# Altium project Pible_MODA.PrjPcb
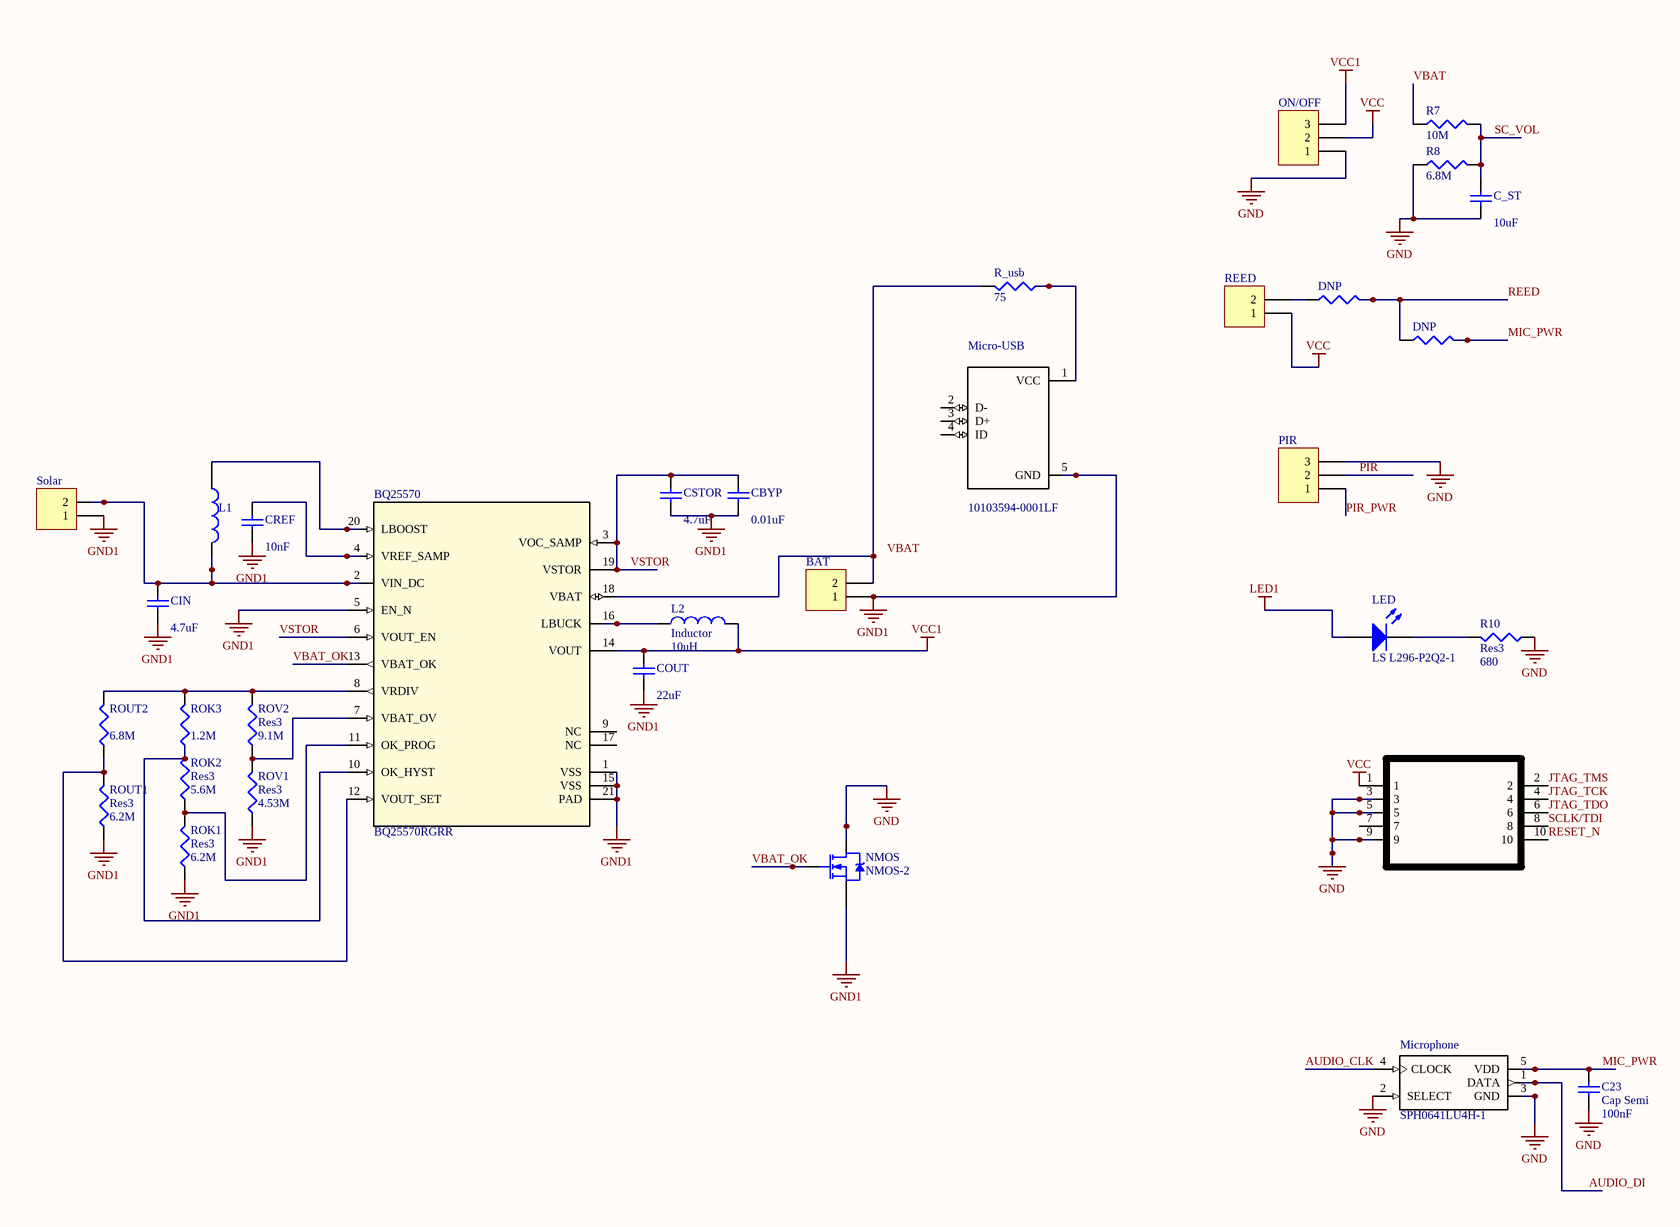
[diagram p0: Pible_MODA.SchDoc, left]
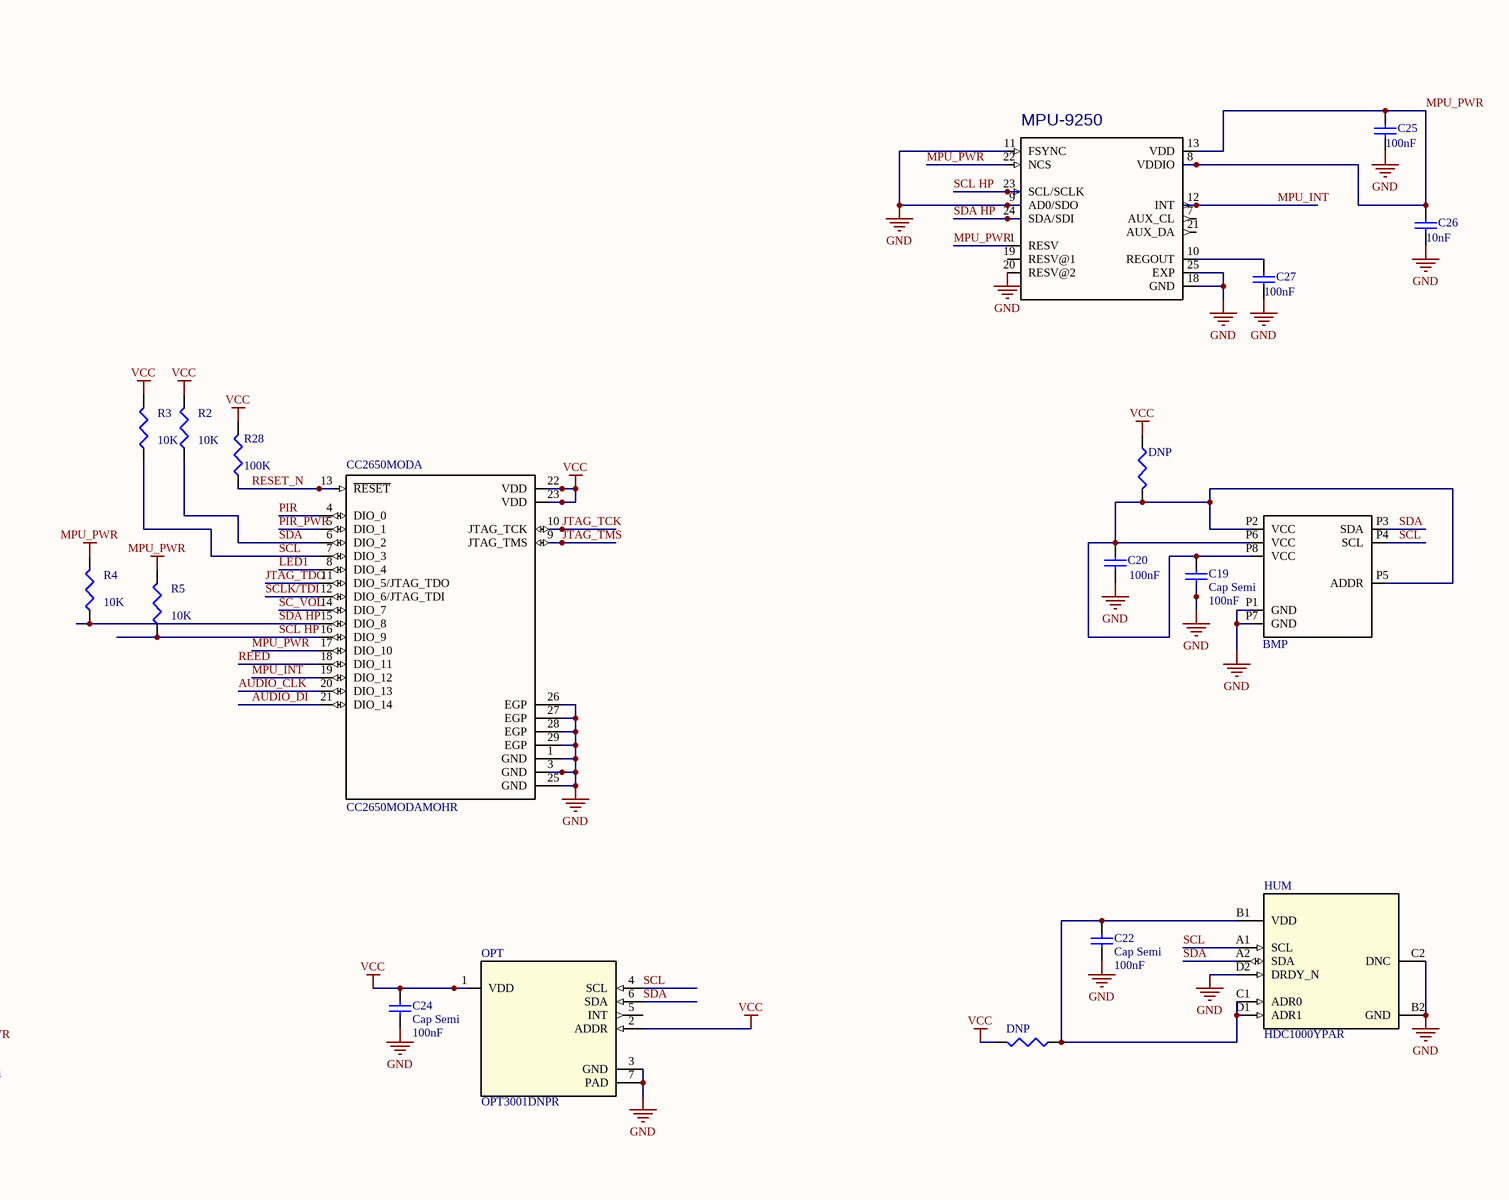
[diagram p1: Pible_MODA.SchDoc, right]
1 sheet, 52 parts. Net scope: global (net labels, ports and power ports of the same name join across sheets).
Board file: Pible_MODA.PcbDoc

## Sheet Pible_MODA.SchDoc
size 635 x 241 mm

### Parts
(Parts that share a designator on the sheet are numbered #1, #2 ... from top to bottom, then left to right.)
BAT  Header 2  [HDR1X2]  (value not drawn)
BMP  BMP280  [LGA-8_BMP280(Primary)]  (value not drawn)
BQ25570  BQ25570RGRR  [RGR0020A]
C19  Cap Semi  value 100nF  [CAPC1608X90]
C20  value 100nF  [CAPC1608X90]  (hidden comment: Cap Semi)
C22  Cap Semi  value 100nF  [CAPC1608X90]
C23  Cap Semi  value 100nF  [1608[0603]]
C24  Cap Semi  value 100nF  [1608[0603]]
C25  value 100nF  [CAPC1608X90]  (hidden comment: Cap Semi)
C26  value 10nF  [CAPC1608X90]  (hidden comment: Cap Semi)
C27  value 100nF  [CAPC1608X90]  (hidden comment: Cap Semi)
C_ST  value 10uF  [1608[0603]]  (hidden comment: Cap Semi)
CBYP  value 0.01uF  [CAPC1608X90]  (hidden comment: Cap Semi)
CC2650MODA  CC2650MODAMOHR  [CC2650MODA_Longer]
CIN  value 4.7uF  [CAPC2012X70]  (hidden comment: Cap Semi)
COUT  value 22uF  [0805]  (hidden comment: Cap Semi)
CREF  value 10nF  [CAPC1608X90]  (hidden comment: Cap Semi)
CSTOR  value 4.7uF  [CAPC1608X90]  (hidden comment: Cap Semi)
DNP#1  Res3  [0402]  (value not drawn)
DNP#2  Res3  [0402]  (value not drawn)
DNP#3  Res3  [0402]  (value not drawn)
DNP#4  Res3  [0402]  (value not drawn)
HUM  HDC1000YPAR  [YPA0008AGAE]
JTAG  FTSH-105-01-L-DV-K  [SAMTEC_FTSH-105-01-L-DV-K]  (value not drawn)
L1  LPS4018-223MRB  [LPS4018]  (value not drawn)
L2  Inductor  value 10uH  [1008HQ]
LED  LS L296-P2Q2-1  [1608]
Micro-USB  10103594-0001LF  [POS-5]
Microphone  SPH0641LU4H-1  [MIC_SPH0641LU4H-1]
MPU-9250  MPU-9250  [QFN40P300X300X105-25N]  (value not drawn)
NMOS  NMOS-2  [SON8-Q5A]
ON/OFF  (no value)  [HDR1X3]
OPT  OPT3001DNPR  [DNP0006A]
PIR  (no value)  [TO-39]
R2  value 10K  [CAPC1608X90]  (hidden comment: Res3)
R3  value 10K  [CAPC1608X90]  (hidden comment: Res3)
R4  value 10K  [CAPC1608X90]  (hidden comment: Res3)
R5  value 10K  [CAPC1608X90]  (hidden comment: Res3)
R7  value 10M  [CAPC1608X90]  (hidden comment: Res3)
R8  value 6.8M  [CAPC1608X90]  (hidden comment: Res3)
R10  Res3  value 680  [Model Name]
R28  value 100K  [CAPC1608X90]
R_usb  value 75  [CAPC1608X90]  (hidden comment: Res3)
REED  Header 2  [HDR1X2]  (value not drawn)
ROK1  Res3  value 6.2M  [CAPC1608X90]
ROK2  Res3  value 5.6M  [CAPC1608X90]
ROK3  value 1.2M  [CAPC1608X90]  (hidden comment: Res3)
ROUT1  Res3  value 6.2M  [CAPC1608X90]
ROUT2  value 6.8M  [CAPC1608X90]  (hidden comment: Res3)
ROV1  Res3  value 4.53M  [CAPC1608X90]
ROV2  Res3  value 9.1M  [CAPC1608X90]
Solar  Header 2  [HDR1X2]  (value not drawn)

### Nets
GND: BMP.P1(GND) BMP.P7(GND) C19.1 C20.2 C22.2 C23.2 C24.2 C25.2 C26.2 C27.2 C_ST.1 CC2650MODA.1(GND) CC2650MODA.3(GND) CC2650MODA.25(GND) CC2650MODA.26(EGP) CC2650MODA.27(EGP) CC2650MODA.28(EGP) CC2650MODA.29(EGP) HUM.B2(GND) HUM.C2(DNC) HUM.D2(DRDY_N) JTAG.3 JTAG.5 JTAG.9 Microphone.2(SELECT) Microphone.3(GND) MPU-9250.9(AD0/SDO) MPU-9250.11(FSYNC) MPU-9250.18(GND) MPU-9250.20(RESV@2) MPU-9250.25(EXP) NMOS.2(D) ON/OFF.1 OPT.3(GND) OPT.7(PAD) PIR.3 R8.1 R10.1
GND1: BAT.1 BQ25570.1(VSS) BQ25570.5(EN_N) BQ25570.15(VSS) BQ25570.21(PAD) CBYP.1 CIN.1 COUT.1 CREF.1 CSTOR.1 Micro-USB.5(GND) NMOS.3(S) ROK1.1 ROUT1.1 ROV1.1 Solar.1
LED1: CC2650MODA.8(DIO_4) LED.1(A)
MPU_PWR: C25.1 C26.1 CC2650MODA.17(DIO_10) MPU-9250.1(RESV) MPU-9250.8(VDDIO) MPU-9250.13(VDD) MPU-9250.22(NCS) R4.2 R5.2
VCC: C24.1 CC2650MODA.22(VDD) CC2650MODA.23(VDD) DNP#3.1 DNP#4.2 JTAG.1 ON/OFF.2 OPT.1(VDD) OPT.2(ADDR) R2.2 R3.2 R28.2 REED.1
VCC1: BQ25570.14(VOUT) COUT.2 L2.2 ON/OFF.3
AUDIO_CLK: CC2650MODA.20(DIO_13) Microphone.4(CLOCK)
AUDIO_DI: CC2650MODA.21(DIO_14) Microphone.1(DATA)
JTAG_TCK: CC2650MODA.10(JTAG_TCK) JTAG.4
JTAG_TDO: CC2650MODA.11(DIO_5/JTAG_TDO) JTAG.6
JTAG_TMS: CC2650MODA.9(JTAG_TMS) JTAG.2
MIC_PWR: C23.1 DNP#2.2 Microphone.5(VDD)
MPU_INT: CC2650MODA.19(DIO_12) MPU-9250.12(INT)
PIR: CC2650MODA.4(DIO_0) PIR.2
PIR_PWR: CC2650MODA.5(DIO_1) PIR.1
REED: CC2650MODA.18(DIO_11) DNP#1.2 DNP#2.1
RESET_N: CC2650MODA.13(~{RESET}) JTAG.10 R28.1
SC_VOL: C_ST.2 CC2650MODA.14(DIO_7) R7.2 R8.2
SCL: BMP.P4(SCL) CC2650MODA.7(DIO_3) HUM.A1(SCL) OPT.4(SCL) R3.1
SCL HP: CC2650MODA.16(DIO_9) MPU-9250.23(SCL/SCLK) R5.1
SCLK/TDI: CC2650MODA.12(DIO_6/JTAG_TDI) JTAG.8
SDA: BMP.P3(SDA) CC2650MODA.6(DIO_2) HUM.A2(SDA) OPT.6(SDA) R2.1
SDA HP: CC2650MODA.15(DIO_8) MPU-9250.24(SDA/SDI) R4.1
VBAT: R7.1
VBAT_OK: BQ25570.13(VBAT_OK) NMOS.1(G)
VSTOR: BQ25570.3(VOC_SAMP) BQ25570.6(VOUT_EN) BQ25570.19(VSTOR) CBYP.2 CSTOR.2
NetBAT_2: BAT.2 BQ25570.18(VBAT) R_usb.2
NetBMP_P2: BMP.P2(VCC) BMP.P5(ADDR) BMP.P6(VCC) BMP.P8(VCC) C19.2 C20.1 DNP#3.2
NetBQ25570_2: BQ25570.2(VIN_DC) CIN.2 L1.2 Solar.2
NetBQ25570_4: BQ25570.4(VREF_SAMP) CREF.2
NetBQ25570_7: BQ25570.7(VBAT_OV) ROV1.2 ROV2.1
NetBQ25570_8: BQ25570.8(VRDIV) ROK3.2 ROUT2.2 ROV2.2
NetBQ25570_10: BQ25570.10(OK_HYST) ROK2.2 ROK3.1
NetBQ25570_11: BQ25570.11(OK_PROG) ROK1.2 ROK2.1
NetBQ25570_12: BQ25570.12(VOUT_SET) ROUT1.2 ROUT2.1
NetBQ25570_16: BQ25570.16(LBUCK) L2.1
NetBQ25570_20: BQ25570.20(LBOOST) L1.1
NetC22_1: C22.1 DNP#4.1 HUM.B1(VDD) HUM.C1(ADR0) HUM.D1(ADR1)
NetC27_1: C27.1 MPU-9250.10(REGOUT)
NetDNP#1_1: DNP#1.1 REED.2
NetLED_2: LED.2(K) R10.2
NetMicro-USB_1: Micro-USB.1(VCC) R_usb.1

Not connected (* = marked no-connect by the designer): BQ25570 9(NC) 17(NC); JTAG 7; Micro-USB 2(D-) 3(D+) 4(ID); MPU-9250 7(AUX_CL) 19(RESV@1) 21(AUX_DA); OPT 5(INT)

### Notes on the sheet
- Labels drawn without touching a wire or pin: VBAT

### Library data of the parts
BAT REED Solar = Header 2: Header, 2-Pin; LatestRevisionDate: 17-Jul-2002; LatestRevisionNote: Re-released for DXP Platform.; Publisher: Altium Limited
BMP = BMP280: BMP280 Absolute Barometric Pressure Sensor for Battery Powered Devices 2 x 2.5mm; MF: Bosch; MP: BMP280; Package: None; Price: Average Price: Â  $2.00 USD; Availability: Good; Value: *
BQ25570 = BQ25570RGRR: Imported; Alternate_PartNumber: BQ25570RGRT; Manufacturer: Texas Instruments; CompType: IC; PIN_COUNT: 21; Application_BuildNumber: *; PartNumber: BQ25570RGRR; PackageReference: RGR0020A; MountType: SMT; RoHS: Y; RefDes: RefDes; TYPE: TYPE; Value: Value
C19 C20 C22-C27 C_ST CBYP CIN COUT CREF CSTOR = Cap Semi: Capacitor (Semiconductor SIM Model); Published: 8-Jun-2000; LatestRevisionDate: 29-May-2009; LatestRevisionNote: IPC-7351 Footprint Added.; PackageReference: C1206; Publisher: Altium Limited; PackageDescription: Chip Capacitor
CC2650MODA = CC2650MODAMOHR: SimpleLink%E2%84%A2 Bluetooth%C2%AE low energy Wireless MCU Module 29-QFM -40 to 85; MF: Texas Instruments; Price: 8.68 USD; Package: SMD-29 Texas Instruments; Availability: Good; MP: CC2650MODAMOHR; Value: *
DNP#1-DNP#4 R2-R5 R7 R8 R10 R28 R_usb ROK1-ROK3 ROUT1 ROUT2 ROV1 ROV2 = Res3: Resistor; Published: 8-Jun-2000; LatestRevisionDate: 29-May-2009; LatestRevisionNote: IPC-7351 Footprint Added.; PackageReference: J1-0603; Publisher: Altium Limited; PackageDescription: Chip Resistor
HUM = HDC1000YPAR: Imported; Alternate_PartNumber: HDC1000YPAT; Manufacturer: Texas Instruments; CompType: IC; PIN_COUNT: 8; PartNumber: HDC1000YPAR; PackageReference: YPA0008AGAE; MountType: SMT; RoHS: Y; RefDes: RefDes; TYPE: TYPE; Value: Value
JTAG = FTSH-105-01-L-DV-K: Conn Unshrouded Header HDR 10 POS 1.27mm Solder ST SMD Automotive Tube; MF: Samtec; Package: None; Price: 2.18 USD; Availability: Good; MP: FTSH-105-01-L-DV-K; Value: *
L1 = LPS4018-223MRB: COILCRAFT - LPS4018-223MRB - INDUCTOR, SHLD, 22UH, 20%, 0.65A, SMD; Supplier_Name: RS; RS Part Number: *; Manufacturer_Name: COILCRAFT; Manufacturer_Part_Number: LPS4018-223MRB; Datasheet Link: http://www.coilcraft.com/pdfs/lps4018.pdf; Height: mm; Allied_Number: *; 3D Package: *; Other Part Number: *
L2 = Inductor: Code_IEC: 1005; Published: 8-Jun-2000; LatestRevisionDate: 29-May-2009; LatestRevisionNote: IPC-7351 Footprint Added.; PackageReference: 0402-A; Publisher: Altium Limited; PackageDescription: Chip Inductor; Code_JEITA: 0402
LED = LED3: Typical BLUE SiC LED; Published: 8-Jun-2000; LatestRevisionDate: 17-Dec-2003; LatestRevisionNote: PCB Footprint replaced.; DatasheetVersion: 16-Apr-2002; PackageVersion: 16-Apr-2002; PackageReference: 3.5X2.8X1.9; Publisher: Altium Limited; PackageDescription: SM LED; 2 C-Bend Leads; Body 3.5 x 2.8 x 1.9 mm, inc leads (LxWxH typ)
Micro-USB = 10103594-0001LF: Conn Micro USB Type B RCP 5 POS 0.65mm Solder RA SMD 5 Terminal 1 Port T/R; MF: Amphenol FCI; SnapEDA_Link: https://www.snapeda.com/parts/10103594-0001LF/Amphenol%20FCI/view-part/?ref=snap; Availability: Unavailable; Price: None; Package: FakePackage u; MP: 10103594-0001LF; Value: *
Microphone = SPH0641LU4H-1: Mic Mems Digital Pdm Omni -26db; MF: Knowles; MP: SPH0641LU4H-1; SnapEDA_Link: https://www.snapeda.com/parts/SPH0641LU4H-1/Knowles/view-part/?ref=snap; Package: MAPBGA-400 NXP Semiconductors; Price: None; Availability: Unavailable; Value: *
MPU-9250 = MPU-9250: SMD%20Gyroscope/Accelerometer/Magnetometer%20Sensor%3B%209-AXIS; MF: InvenSense; Package: QFN-24 InvenSense; Price: 6.51 USD; MP: MPU-9250; Availability: Good; Value: *
NMOS = NMOS-2: N-Channel Power MOSFET; pin to pad: 1>4 2>7 3>1; Note: Pin 2 is electrically connected to pin 4.; Published: 8-Jun-2000; LatestRevisionDate: 17-Jul-2002; LatestRevisionNote: Re-released for DXP Platform.; DatasheetVersion: PD-9.814; PackageVersion: Feb-1997; PackageReference: TO-220AB; Publisher: Altium Limited; PackageDescription: TO, Thru-Hole, Vertical, Heatsink Mounted; 3 In-Line Leads; Pitch 2.54 mm; ComponentLink1Description: Manufacturer Link; ComponentLink1URL: http://www.irf.com/
ON/OFF PIR = Header 3: Header, 3-Pin; LatestRevisionDate: 17-Jul-2002; LatestRevisionNote: Re-released for DXP Platform.; Publisher: Altium Limited
OPT = OPT3001DNPR: Imported; Manufacturer: Texas Instruments; CompType: IC; PIN_COUNT: 7; Application_BuildNumber: *; PartNumber: OPT3001DNP; PackageReference: DNP0006A; MountType: SMT; RoHS: Y; RefDes: RefDes; TYPE: TYPE; Value: Value